# EAGLE design 258-Verteilerplatine-2fach_8-14P (EAGLE 9.6.2)
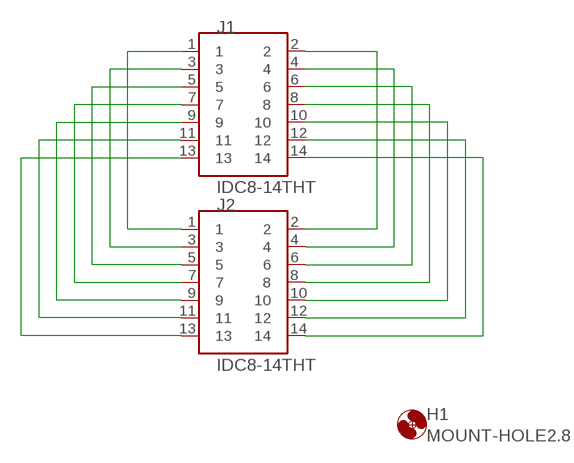
[diagram p0: schematic, sheet 1]

## Parts
H1  MOUNT-HOLE2.8  [2,8]
J1  IDC8-14THT  [IDC8-14]
J2  IDC8-14THT  [IDC8-14]

## Nets
N$1: J1.1 J2.1
N$2: J1.3 J2.3
N$3: J1.5 J2.5
N$4: J1.7 J2.7
N$5: J1.9 J2.9
N$6: J1.11 J2.11
N$8: J1.13 J2.13
N$9: J1.2 J2.2
N$10: J1.4 J2.4
N$11: J1.6 J2.6
N$12: J1.8 J2.8
N$13: J1.10 J2.10
N$14: J1.12 J2.12
N$15: J1.14 J2.14

## Library data of the parts
H1 = holes:MOUNT-HOLE: MOUNTING HOLE with drill center marker
J1 J2 = HD_Kontakte:IDC8-14

## Board
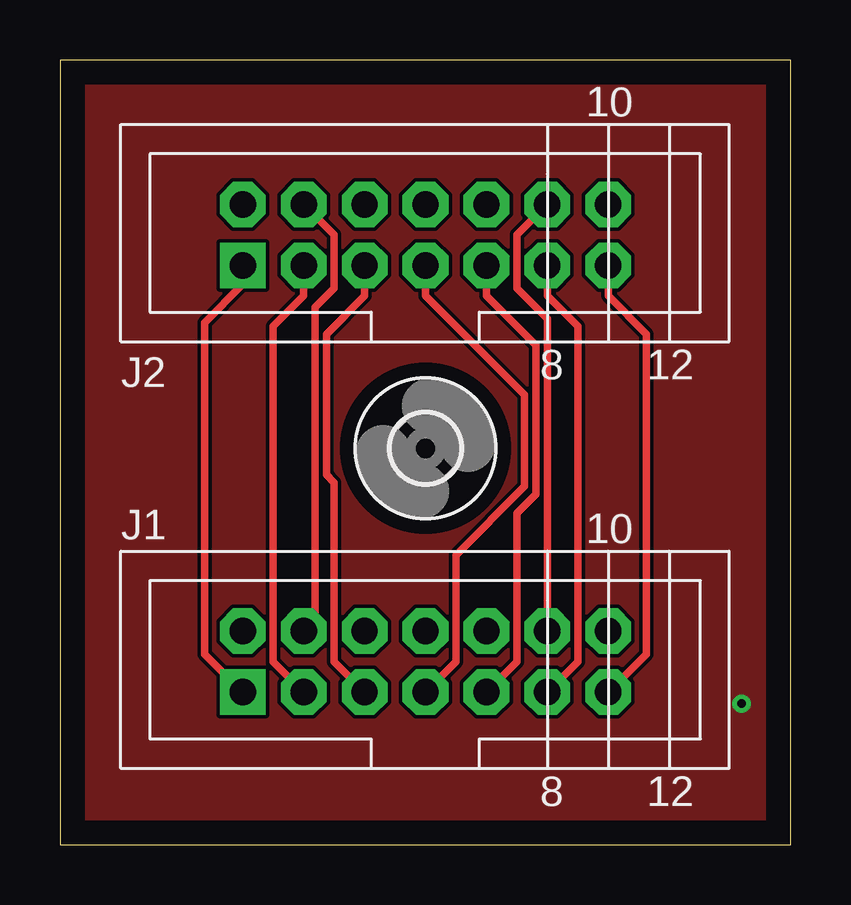
[diagram p1: board, top side]
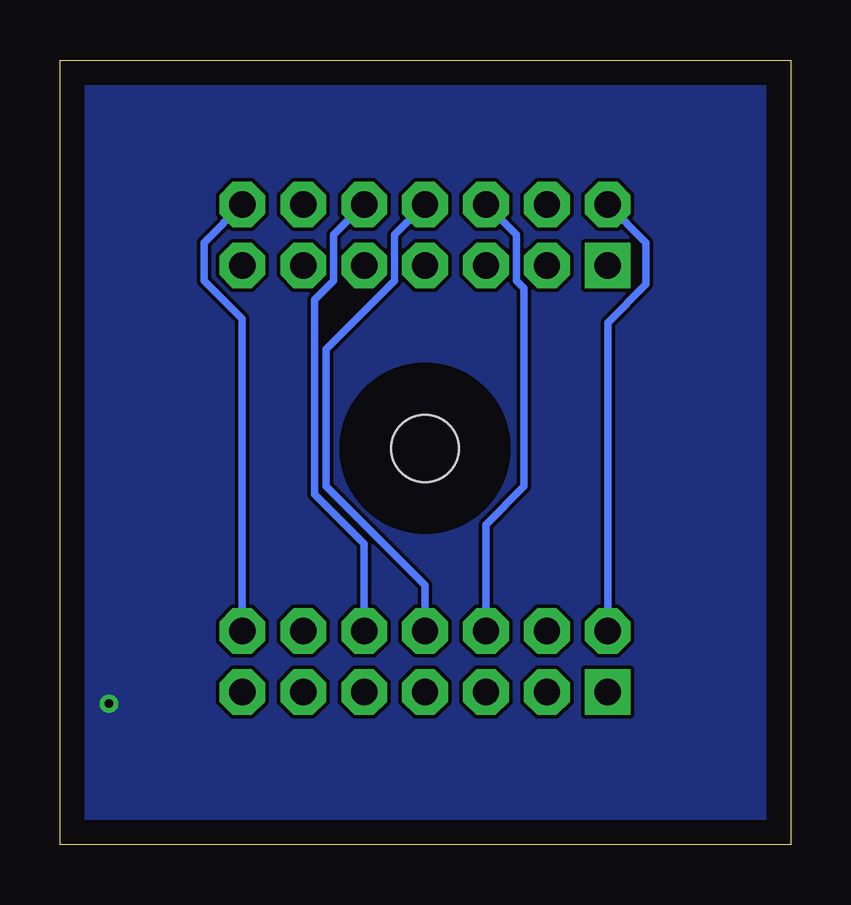
[diagram p2: board, bottom side, seen from below]

Size 30.46 x 32.69 mm. Coordinates in mm from the lower left corner, seen from the top.
Outline: 0,0 30.46,0 30.46,32.69 0,32.69 0,0
Copper layers (1*16): Top 0.035mm / dielectric 1.5mm / Bottom 0.035mm
Design rules "default *": minimum track width 12mil, minimum drill 0.35mm, track to track 6mil, track to pad 6mil, pad to pad 6mil, via to via 6mil, smd to smd 6mil, copper to edge 40mil, drill to drill 6mil, minimum pad ring 10mil, minimum via ring 8mil, stop-mask expansion 4mil, vias tented up to drill 0mil, thermal gap 10mil

### Footprints (pad centres in the part's own frame; a part is rotated, then mirrored left to right if it is on the bottom)
2,8 = hole 2.8: 0,0
IDC8-14 = drill 1.1 pad 1.9 square: 1 -7.62,-1.27 | drill 1.1 pad 1.9 octagon: 2 -7.62,1.27; 3 -5.08,-1.27; 4 -5.08,1.27; 5 -2.54,-1.27; 6 -2.54,1.27; 7 0,-1.27; 8 0,1.27; 9 2.54,-1.27; 10 2.54,1.27; 11 5.08,-1.27; 12 5.08,1.27; 13 7.62,-1.27; 14 7.62,1.27

### Placement (x,y rotation side)
H1  15.24,16.51 0 top
J1  15.24,7.62 0 top
J2  15.24,25.4 0 top

### Tracks (layer width: path | path; a pad name or v marks a point on that pad's centre or on a via)
GND  (via drill 0.35)
  other vias: 28.42,5.87
  pour Top: 0,33.02 30.48,33.02 30.48,0 0,0
  pour Bottom: 0,33.02 30.48,33.02 30.48,0 0,0
N$1
  Top 0.305: J1.1 6.03,7.94 6.03,21.75 7.62,23.34 J2.1
N$2
  Top 0.305: J1.3 8.89,7.62 8.89,21.59 10.16,22.86 J2.3
N$3
  Top 0.305: J1.5 11.43,7.62 11.43,15.08 11.11,15.4 11.11,21.27 12.7,22.86 J2.5
N$4
  Top 0.305: J1.7 16.51,7.62 16.51,12.06 19.37,14.92 19.37,18.73 15.24,22.86 J2.7
N$5
  Top 0.305: J1.9 19.05,7.62 19.05,13.81 19.84,14.61 19.84,20.8 17.78,22.86 J2.9
N$6
  Top 0.305: J1.11 21.59,7.62 21.59,21.59 20.32,22.86 J2.11
N$8
  Top 0.305: J1.13 24.45,7.94 24.45,21.27 22.86,22.86 J2.13
N$9
  Bottom 0.305: J1.2 7.62,21.75 6.03,23.34 6.03,25.08 J2.2
N$10
  Top 0.305: J1.4 10.64,9.37 10.64,22.38 11.43,23.18 11.43,25.4 J2.4
N$11
  Bottom 0.305: J1.6 12.7,13.34 11.11,14.92 11.11,23.18 11.43,23.5 11.43,25.4 J2.6
N$12
  Bottom 0.305: J1.8 15.24,10.79 19.37,14.92 19.37,20.64 16.51,23.5 16.51,25.4 J2.8
N$13
  Bottom 0.305: J1.10 17.78,12.54 19.84,14.61 19.84,22.7 19.05,23.5 19.05,25.4 J2.10
N$14
  Top 0.305: J1.12 20.32,21.91 19.05,23.18 19.05,25.4 J2.12
N$15
  Bottom 0.305: J1.14 22.86,21.91 24.45,23.5 24.45,25.08 J2.14

### Text on the board
bDocu: 258-Verteilerplatine | 2fach_8-14P | by Dominik & Hans | Ver 1.0 - 2022-07-26